# Altium schematic sheet Check-Sheet.SchDoc
size A4
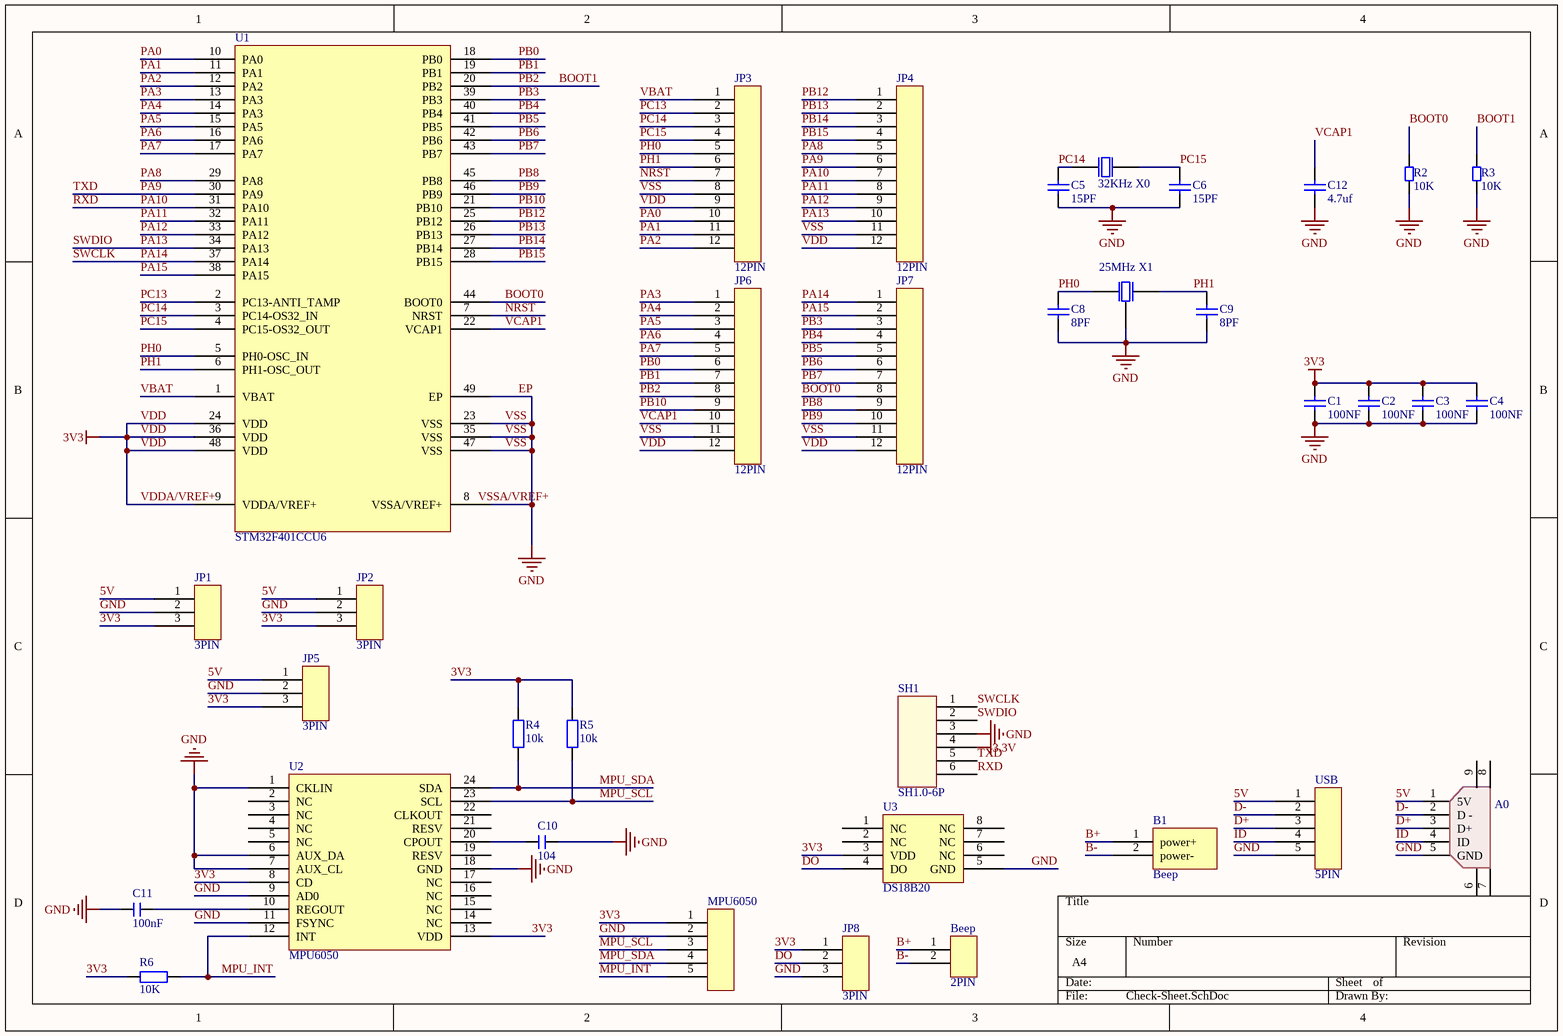
[diagram p0: Check-Sheet.SchDoc]

## Parts
25MHz_X1  XTAL 3225 8M  [OSC 3225-4P]  (value not drawn)
32KHz_X0  XTAL 3215 32.768kKHz  [OSC 3215-2P]  (value not drawn)
A0  Micro USB  [USB-micro_A]  (value not drawn)
B1  Beep  [5020beep]
Beep  2PIN  [2PIN]
C1  100NF  [C 0603_M]
C2  100NF  [C 0603_M]
C3  100NF  [C 0603_M]
C4  100NF  [C 0603_M]
C5  15PF  [C 0603_M]
C6  15PF  [C 0603_M]
C8  8PF  [C 0603_M]
C9  8PF  [C 0603_M]
C10  104  [C 0805_L]
C11  100nF  [C 0805_L]
C12  value 4.7uf  [C 0603_M]  (hidden comment: Cap Chip 0603)
JP1  3PIN  [3pin]
JP2  3PIN  [3pin]
JP3  12PIN  [12PIN]
JP4  12PIN  [12PIN]
JP5  3PIN  [3pin]
JP6  12PIN  [12PIN]
JP7  12PIN  [12PIN]
JP8  3PIN  [3pin]
MPU6050  5PIN  [5PIN]  (value not drawn)
R2  10K  [R 0603_M]
R3  10K  [R 0603_M]
R4  10k  [0603R]
R5  10k  [0603R]
R6  10K  [0603R]
SH1  SH1.0-6P  [6PIN]
U1  STM32F401CCU6  [QFN48 7X7_M]
U2  MPU6050  [QFN24]
U3  DS18B20  [SOP8]
USB  5PIN  [5PIN]

## Nets
3.3V: SH1.4
3V3: C1.2 C2.2 C3.2 C4.2 JP1.3 JP2.3 JP3.9 JP4.12 JP5.3 JP6.12 JP7.12 JP8.1 MPU6050.1 R4.2 R5.2 R6.1 U1.9(VDDA/VREF+) U1.24(VDD) U1.36(VDD) U1.48(VDD) U2.8(CD) U2.13(VDD) U3.3(VDD)  [also labelled VDD, VDDA/VREF+]
EP: 25MHz_X1.3(GND) A0.5(GND) C1.1 C2.1 C3.1 C4.1 C5.1 C6.1 C8.1 C9.1 C10.2 C11.1 C12.1 JP1.2 JP2.2 JP3.8 JP4.11 JP5.2 JP6.11 JP7.11 JP8.3 MPU6050.2 R2.1 R3.1 SH1.3 U1.8(VSSA/VREF+) U1.23(VSS) U1.35(VSS) U1.47(VSS) U1.49(EP) U2.1(CKLIN) U2.6(AUX_DA) U2.7(AUX_CL) U2.9(AD0) U2.11(FSYNC) U2.18(GND) U3.5(GND) USB.5  [also labelled GND, VSS]
5V: A0.1(5V) JP1.1 JP2.1 JP5.1 USB.1
B+: B1.1(power+) Beep.1
B-: B1.2(power-) Beep.2
BOOT0: JP7.8 R2.2 U1.44(BOOT0)
BOOT1: JP6.8 R3.2 U1.20(PB2)  [also labelled PB2]
D+: A0.3(D+) USB.3
D-: A0.2(D_-) USB.2
DO: JP8.2 U3.4(DO)
ID: A0.4(ID) USB.4
MPU_INT: MPU6050.5 R6.2 U2.12(INT)
MPU_SCL: MPU6050.3 R5.1 U2.23(SCL)
MPU_SDA: MPU6050.4 R4.1 U2.24(SDA)
NRST: JP3.7 U1.7(NRST)
PA0: JP3.10 U1.10(PA0)
PA1: JP3.11 U1.11(PA1)
PA2: JP3.12 U1.12(PA2)
PA3: JP6.1 U1.13(PA3)
PA4: JP6.2 U1.14(PA3)
PA5: JP6.3 U1.15(PA5)
PA6: JP6.4 U1.16(PA6)
PA7: JP6.5 U1.17(PA7)
PA8: JP4.5 U1.29(PA8)
PA9: JP4.6 SH1.5 U1.30(PA9)  [also labelled TXD]
PA10: JP4.7 SH1.6 U1.31(PA10)  [also labelled RXD]
PA11: JP4.8 U1.32(PA11)
PA12: JP4.9 U1.33(PA12)
PA13: JP4.10 SH1.2 U1.34(PA13)  [also labelled SWDIO]
PA14: JP7.1 SH1.1 U1.37(PA14)  [also labelled SWCLK]
PA15: JP7.2 U1.38(PA15)
PB0: JP6.6 U1.18(PB0)
PB1: JP6.7 U1.19(PB1)
PB3: JP7.3 U1.39(PB3)
PB4: JP7.4 U1.40(PB4)
PB5: JP7.5 U1.41(PB5)
PB6: JP7.6 U1.42(PB6)
PB7: JP7.7 U1.43(PB7)
PB8: JP7.9 U1.45(PB8)
PB9: JP7.10 U1.46(PB9)
PB10: JP6.9 U1.21(PB10)
PB12: JP4.1 U1.25(PB12)
PB13: JP4.2 U1.26(PB13)
PB14: JP4.3 U1.27(PB14)
PB15: JP4.4 U1.28(PB15)
PC13: JP3.2 U1.2(PC13-ANTI_TAMP)
PC14: 32KHz_X0.1(OSC1) C5.2 JP3.3 U1.3(PC14-OS32_IN)
PC15: 32KHz_X0.2(OSC2) C6.2 JP3.4 U1.4(PC15-OS32_OUT)
PH0: 25MHz_X1.1(OSC1) C8.2 JP3.5 U1.5(PH0-OSC_IN)
PH1: 25MHz_X1.2(OSC2) C9.2 JP3.6 U1.6(PH1-OSC_OUT)
VBAT: JP3.1 U1.1(VBAT)
VCAP1: C12.2 JP6.10 U1.22(VCAP1)
NetC10_1: C10.1 U2.20(CPOUT)
NetC11_2: C11.2 U2.10(REGOUT)

Not connected (* = marked no-connect by the designer): A0 6 7 8 9; U2 2(NC) 3(NC) 4(NC) 5(NC) 14(NC) 15(NC) 16(NC) 17(NC) 19(RESV) 21(RESV) 22(CLKOUT); U3 1(NC) 2(NC) 6(NC) 7(NC) 8(NC)

## Notes on the sheet
- Labels drawn without touching a wire or pin: VSSA/VREF+

## Library data of the parts
C1-C6 C8 C9 = 0402 CAP
C10 C11 = C: 无极性贴片电容; 版权归属: 源创客; BOM名称: 无极性贴片电容; 学习资源: www.ooocke.com
C12 = Cap Chip 0603: Polarized Capacitor (Radial); Published: 8-Jun-2000; Revision: July-2002: Re-released for DXP Platform.; Publisher: Altium Limited
R2 R3 = 0402 RES
R4-R6 = R: 贴片电阻; 版权归属: 源创客; BOM名称: 贴片电阻; 学习资源: www.ooocke.com
SH1 = SH1.0-6P: 间距为1mm的端子